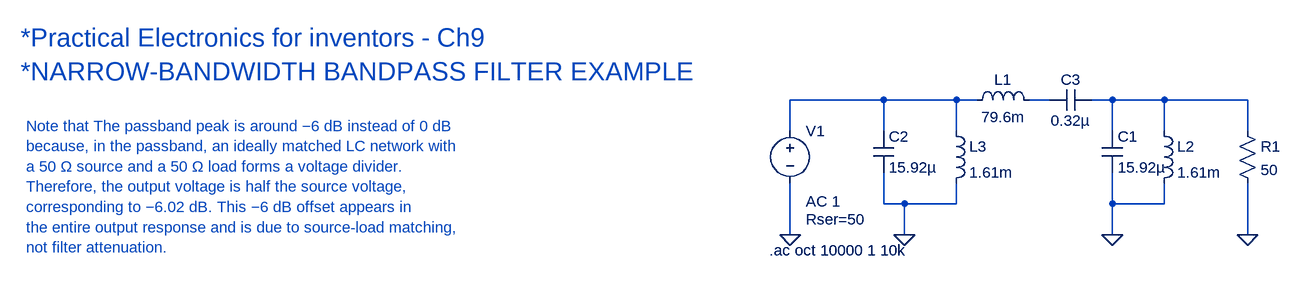
[diagram p0: schematic Filters - Passive LC Band Pass Filter - 3rd order.asc]
Filters - Passive LC Band Pass Filter - 3rd order.asc, the LTspice schematic file:
Version 4.1
SHEET 1 3196 680
WIRE 128 96 -16 96
WIRE 240 96 128 96
WIRE 272 96 240 96
WIRE 384 96 352 96
WIRE 480 96 448 96
WIRE 560 96 480 96
WIRE 688 96 560 96
WIRE -16 144 -16 96
WIRE 128 144 128 96
WIRE 240 144 240 96
WIRE 480 144 480 96
WIRE 560 144 560 96
WIRE 688 144 688 96
WIRE 128 256 128 208
WIRE 160 256 128 256
WIRE 240 256 240 224
WIRE 240 256 160 256
WIRE 480 256 480 208
WIRE 560 256 560 224
WIRE 560 256 480 256
WIRE -16 304 -16 224
WIRE 160 304 160 256
WIRE 480 304 480 256
WIRE 688 304 688 224
FLAG -16 304 0
FLAG 160 304 0
FLAG 480 304 0
FLAG 688 304 0
SYMBOL voltage -16 128 R0
WINDOW 123 24 124 Left 2
WINDOW 39 24 152 Left 2
SYMATTR InstName V1
SYMATTR Value ""
SYMATTR Value2 AC 1
SYMATTR SpiceLine Rser=50
SYMBOL res 672 128 R0
SYMATTR InstName R1
SYMATTR Value 50
SYMBOL ind 256 112 R270
WINDOW 0 32 56 VTop 2
WINDOW 3 5 56 VBottom 2
SYMATTR InstName L1
SYMATTR Value 79.6m
SYMATTR SpiceLine Rser=1m
SYMBOL cap 464 144 R0
SYMATTR InstName C1
SYMATTR Value 15.92µ
SYMBOL cap 112 144 R0
SYMATTR InstName C2
SYMATTR Value 15.92µ
SYMBOL ind 544 128 R0
SYMATTR InstName L2
SYMATTR Value 1.61m
SYMATTR SpiceLine Rser=1m
SYMBOL ind 224 128 R0
SYMATTR InstName L3
SYMATTR Value 1.61m
SYMATTR SpiceLine Rser=1m
SYMBOL cap 448 80 R90
WINDOW 0 0 32 VBottom 2
WINDOW 3 32 32 VTop 2
SYMATTR InstName C3
SYMATTR Value 0.32µ
TEXT -48 328 Left 2 !.ac oct 10000 1 10k
TEXT -1192 136 Left 2 ;Note that The passband peak is around −6 dB instead of 0 dB\nbecause, in the passband, an ideally matched LC network with \na 50 Ω source and a 50 Ω load forms a voltage divider. \nTherefore, the output voltage is half the source voltage, \ncorresponding to −6.02 dB. This −6 dB offset appears in \nthe entire output response and is due to source-load matching,\nnot filter attenuation.
TEXT -1200 0 Left 4 ;*Practical Electronics for inventors - Ch9\n*NARROW-BANDWIDTH BANDPASS FILTER EXAMPLE

The netlist it stands for:
* Filters - Passive LC Band Pass Filter - 3rd order.asc
V1 N001 0 AC 1 Rser=50
R1 N003 0 50
L1 N001 N002 79.6m Rser=1m
C1 N003 0 15.92µ
C2 N001 0 15.92µ
L2 N003 0 1.61m Rser=1m
L3 N001 0 1.61m Rser=1m
C3 N003 N002 0.32µ
.ac oct 10000 1 10k
* Note that The passband peak is around −6 dB instead of 0 dB
* because, in the passband, an ideally matched LC network with
* a 50 Ω source and a 50 Ω load forms a voltage divider.
* Therefore, the output voltage is half the source voltage,
* corresponding to −6.02 dB. This −6 dB offset appears in
* the entire output response and is due to source-load matching,
* not filter attenuation.
* *Practical Electronics for inventors - Ch9
* *NARROW-BANDWIDTH BANDPASS FILTER EXAMPLE
.backanno
.end